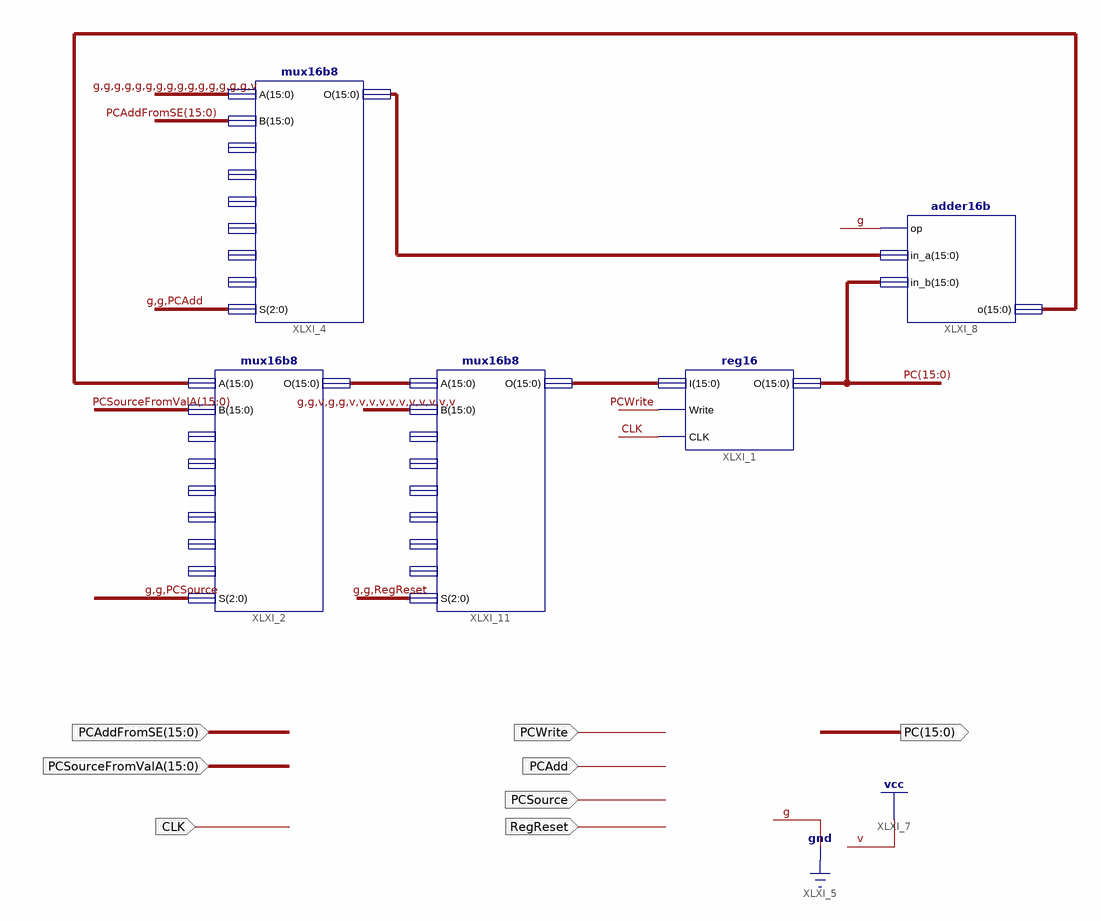
[diagram p0: schematic sheet 1]
// Xilinx ISE schematic stage1PCIncrementerSch.sch (spartan3e) as structural Verilog: 5 symbols, 8 ports
module stage1PCIncrementerSch (
  input  [15:0] PCSourceFromValA,
  input  [15:0] PCAddFromSE,
  input  PCWrite,
  input  CLK,
  input  PCAdd,
  input  PCSource,
  input  RegReset,
  output [15:0] PC
);

  wire g;
  wire [15:0] XLXN_4, XLXN_10, XLXN_20, XLXN_21;

  mux16b8 XLXI_2 (.A(XLXN_10), .B(PCSourceFromValA), .S({{2{g}}, PCSource}), .O(XLXN_20));  // open: C, D, E, F, G, H
  mux16b8 XLXI_4 (.A({{15{g}}, 1'b1}), .B(PCAddFromSE), .S({{2{g}}, PCAdd}), .O(XLXN_4));  // open: C, D, E, F, G, H
  reg16 XLXI_1 (.I(XLXN_21), .Write(PCWrite), .CLK(CLK), .O(PC));
  adder16b XLXI_8 (.op(g), .in_a(XLXN_4), .in_b(PC), .o(XLXN_10));
  mux16b8 XLXI_11 (
    .A(XLXN_20), .B({{2{g}}, 1'b1, {2{g}}, {11{1'b1}}}), .S({{2{g}}, RegReset}), .O(XLXN_21));  // open: C, D, E, F, G, H
  // also tied to GND on the sheet: g
endmodule
